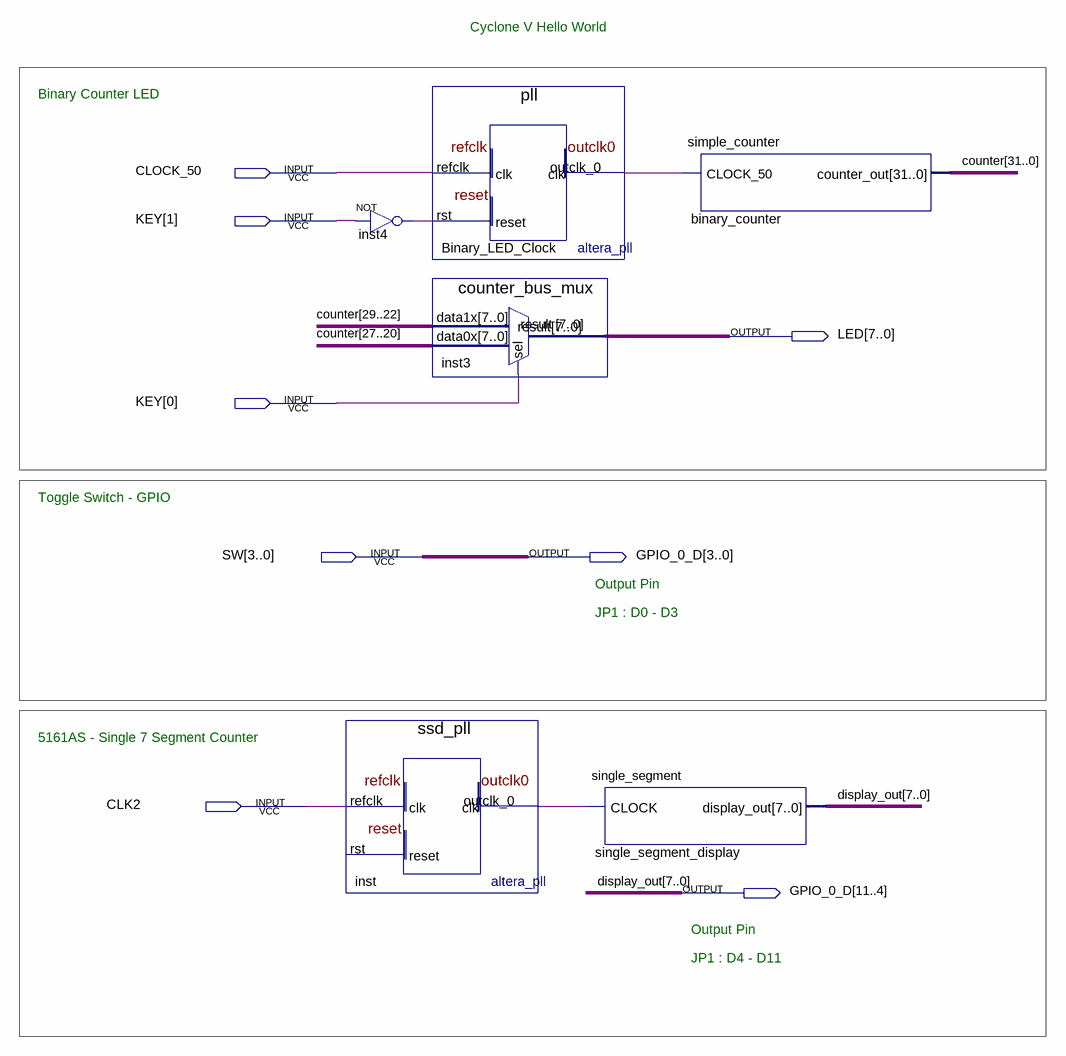
[diagram p0: schematic sheet]
// Quartus schematic HelloWorld.bdf as structural Verilog: 6 symbols, 8 pins
module HelloWorld (
  input  CLOCK_50,
  input  [1:0] KEY,
  input  [3:0] SW,
  input  CLK2,
  output [7:0] LED,
  output [11:0] GPIO_0_D
);

  wire Binary_LED_Clock_outclk_0, inst4_out, inst_outclk_0;
  wire [31:0] counter;

  not inst4 (inst4_out, KEY[1]);
  ssd_pll inst (.refclk(CLK2), .outclk_0(inst_outclk_0));  // open: rst
  pll Binary_LED_Clock (.refclk(CLOCK_50), .rst(inst4_out), .outclk_0(Binary_LED_Clock_outclk_0));
  counter_bus_mux inst3 (.data1x(counter[29:22]), .data0x(counter[27:20]), .sel(KEY[0]), .result(LED));
  single_segment single_segment_display (.CLOCK(inst_outclk_0), .display_out(GPIO_0_D[11:4]));
  simple_counter binary_counter (.CLOCK_50(Binary_LED_Clock_outclk_0), .counter_out(counter));

  assign GPIO_0_D[3:0] = SW;

  // Other names for the same wires on the sheet: display_out[7:0] = GPIO_0_D[11:4]; result[7:0] = LED

  // Notes on the sheet:
  //   Cyclone V Hello World
  //   Binary Counter LED
  //   Toggle Switch - GPIO
  //   Output Pin
  //   JP1 : D0 - D3
  //   5161AS - Single 7 Segment Counter
  //   Output Pin
  //   JP1 : D4 - D11
endmodule
